# Altium schematic sheet sheet 1 final.SchDoc
size A4
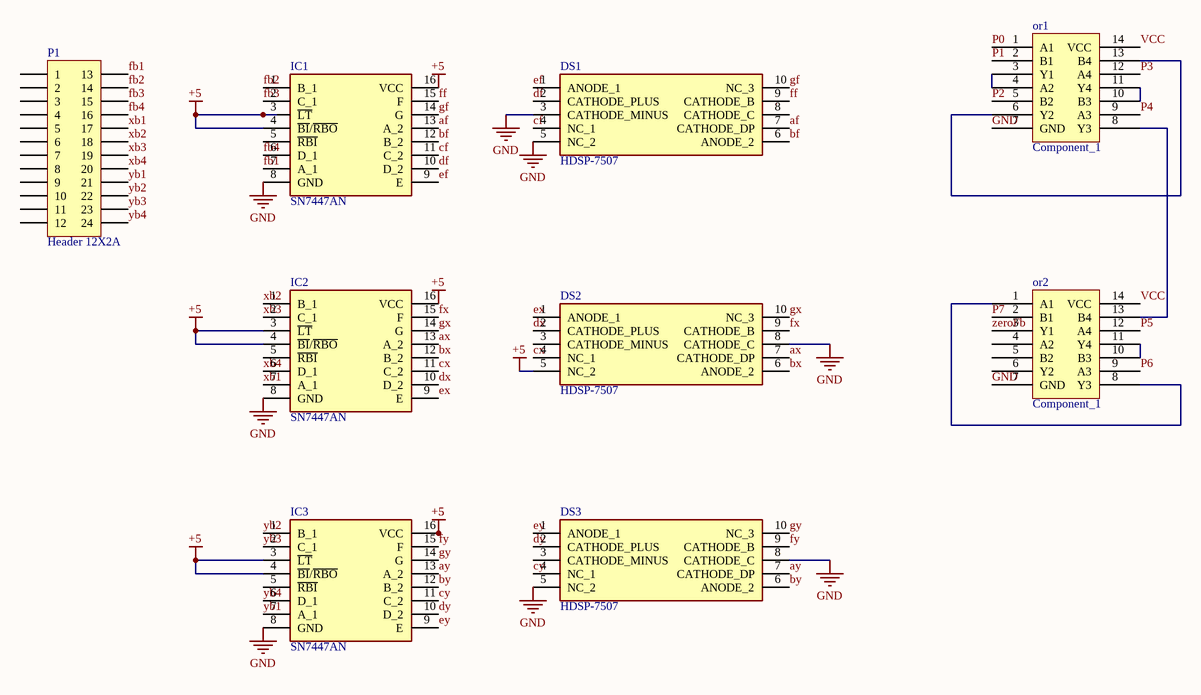
[diagram p0: sheet 1 final.SchDoc]

## Parts
DS1  HDSP-7507  [DIPS508W51P254L1270H609Q10N]
DS2  HDSP-7507  [DIPS508W51P254L1270H609Q10N]
DS3  HDSP-7507  [DIPS508W51P254L1270H609Q10N]
IC1  SN7447AN  [DIP762W66P254L2134H508Q16N]
IC2  SN7447AN  [DIP762W66P254L2134H508Q16N]
IC3  SN7447AN  [DIP762W66P254L2134H508Q16N]
or1  Component_1  [PCBComponent_1]
or2  Component_1  [PCBComponent_1]
P1  Header 12X2A  [HDR2X12_CEN]

## Nets
+5: DS2.5(NC_2) IC1.3(~{LT}) IC1.4(~{BI}/~{RBO}) IC1.16(VCC) IC2.3(~{LT}) IC2.4(~{BI}/~{RBO}) IC2.16(VCC) IC3.3(~{LT}) IC3.4(~{BI}/~{RBO}) IC3.16(VCC)
GND: DS1.3(CATHODE_MINUS) DS1.5(NC_2) DS2.8(CATHODE_C) DS3.5(NC_2) DS3.8(CATHODE_C) IC1.8(GND) IC2.8(GND) IC3.8(GND) or1.7(GND) or2.7(GND)
af: DS1.7(CATHODE_DP) IC1.13(A_2)
ax: DS2.7(CATHODE_DP) IC2.13(A_2)
ay: DS3.7(CATHODE_DP) IC3.13(A_2)
bf: DS1.6(ANODE_2) IC1.12(B_2)
bx: DS2.6(ANODE_2) IC2.12(B_2)
by: DS3.6(ANODE_2) IC3.12(B_2)
cf: DS1.4(NC_1) IC1.11(C_2)
cx: DS2.4(NC_1) IC2.11(C_2)
cy: DS3.4(NC_1) IC3.11(C_2)
df: DS1.2(CATHODE_PLUS) IC1.10(D_2)
dx: DS2.2(CATHODE_PLUS) IC2.10(D_2)
dy: DS3.2(CATHODE_PLUS) IC3.10(D_2)
ef: DS1.1(ANODE_1) IC1.9(E)
ex: DS2.1(ANODE_1) IC2.9(E)
ey: DS3.1(ANODE_1) IC3.9(E)
fb1: IC1.7(A_1) P1.13
fb2: IC1.1(B_1) P1.14
fb3: IC1.2(C_1) P1.15
fb4: IC1.6(D_1) P1.16
ff: DS1.9(CATHODE_B) IC1.15(F)
fx: DS2.9(CATHODE_B) IC2.15(F)
fy: DS3.9(CATHODE_B) IC3.15(F)
gf: DS1.10(NC_3) IC1.14(G)
gx: DS2.10(NC_3) IC2.14(G)
gy: DS3.10(NC_3) IC3.14(G)
P0: or1.1(A1)
P1: or1.2(B1)
P2: or1.5(B2)
P3: or1.12(A4)
P4: or1.9(A3)
P5: or2.12(A4)
P6: or2.9(A3)
P7: or2.2(B1)
VCC: or1.14(VCC) or2.14(VCC)
xb1: IC2.7(A_1) P1.17
xb2: IC2.1(B_1) P1.18
xb3: IC2.2(C_1) P1.19
xb4: IC2.6(D_1) P1.20
yb1: IC3.7(A_1) P1.21
yb2: IC3.1(B_1) P1.22
yb3: IC3.2(C_1) P1.23
yb4: IC3.6(D_1) P1.24
zeroFb: or2.3(Y1)
Netor1_3: or1.3(Y1) or1.4(A2)
Netor1_6: or1.6(Y2) or1.13(B4)
Netor1_8: or1.8(Y3) or2.13(B4)
Netor1_10: or1.10(B3) or1.11(Y4)
Netor2_1: or2.1(A1) or2.8(Y3)
Netor2_10: or2.10(B3) or2.11(Y4)

Not connected (* = marked no-connect by the designer): DS1 8(CATHODE_C); DS2 3(CATHODE_MINUS); DS3 3(CATHODE_MINUS); IC1 5(~{RBI}); IC2 5(~{RBI}); IC3 5(~{RBI}); or2 4(A2) 5(B2) 6(Y2); P1 1 2 3 4 5 6 7 8 9 10 11 12

## Library data of the parts
DS1-DS3 = HDSP-7507: Display; Manufacturer_Name: Avago Technologies; Datasheet Link: https://media.digikey.com/pdf/Data%20Sheets/Avago%20PDFs/HDSP-740x%20Series.pdf; Height: 6.09mm; Manufacturer_Part_Number: HDSP-7507; Mouser Part Number: 630-HDSP-7507; Mouser Price/Stock: https://www.mouser.com/Search/Refine.aspx?Keyword=630-HDSP-7507
IC1-IC3 = SN7447AN: Integrated Circuit; Manufacturer_Name: Texas Instruments; Datasheet Link: https://componentsearchengine.com/Datasheets/2/SN7447AN.pdf; Height: 5.08mm; Manufacturer_Part_Number: SN7447AN; Mouser Part Number: 595-SN7447AN; Mouser Price/Stock: https://www.mouser.com/Search/Refine.aspx?Keyword=595-SN7447AN; RS Part Number: 0305406P; RS Price/Stock: http://uk.rs-online.com/web/p/products/0305406P
P1 = Header 12X2A: Header, 12-Pin, Dual row; LatestRevisionDate: 17-Jul-2002; LatestRevisionNote: Re-released for DXP Platform.; Publisher: Altium Limited